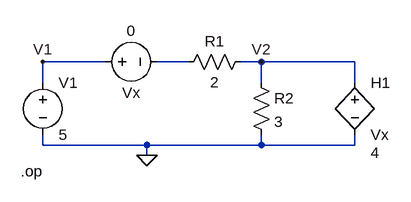
[diagram p0: schematic nodal12.asc]
nodal12.asc, the LTspice schematic file:
Version 4
SHEET 1 880 680
WIRE -160 64 -256 64
WIRE -32 64 -80 64
WIRE 80 64 48 64
WIRE 224 64 80 64
WIRE -256 96 -256 64
WIRE 80 96 80 64
WIRE 224 96 224 64
WIRE -256 192 -256 176
WIRE -96 192 -256 192
WIRE 80 192 80 176
WIRE 80 192 -96 192
WIRE 224 192 224 176
WIRE 224 192 80 192
WIRE -96 208 -96 192
FLAG -96 208 0
FLAG 80 64 V2
FLAG -256 64 V1
DATAFLAG 64 64 ""
DATAFLAG -224 64 ""
SYMBOL res 64 48 R90
WINDOW 0 0 56 VBottom 2
WINDOW 3 32 56 VTop 2
SYMATTR InstName R1
SYMATTR Value 2
SYMBOL res 64 80 R0
SYMATTR InstName R2
SYMATTR Value 3
SYMBOL voltage -256 80 R0
WINDOW 123 0 0 Left 0
WINDOW 39 0 0 Left 0
SYMATTR InstName V1
SYMATTR Value 5
SYMBOL voltage -176 64 R270
WINDOW 0 -32 56 VBottom 2
WINDOW 3 32 56 VTop 2
WINDOW 123 0 0 Left 0
WINDOW 39 0 0 Left 0
SYMATTR InstName Vx
SYMATTR Value 0
SYMBOL h 224 80 R0
WINDOW 123 24 124 Left 2
SYMATTR InstName H1
SYMATTR Value Vx
SYMATTR Value2 4
TEXT -290 232 Left 2 !.op

The netlist it stands for:
* nodal12.asc
R1 V2 N001 2
R2 V2 0 3
V1 V1 0 5
Vx V1 N001 0
H1 V2 0 Vx 4
.op
.backanno
.end